# EasyEDA Pro project 4040M主控板V1.0 - ESP32.eprj

# Schematic 原理图
Board Name: ESP32s3; Create Date: 2025-05-14; Page Name: 电源; Project Name: 4040M主控板V1.0; Schematic Name: 原理图; Update Date: 2026-04-21; Company: 嘉立创EDA; Page Size: A3; Version: V1.0
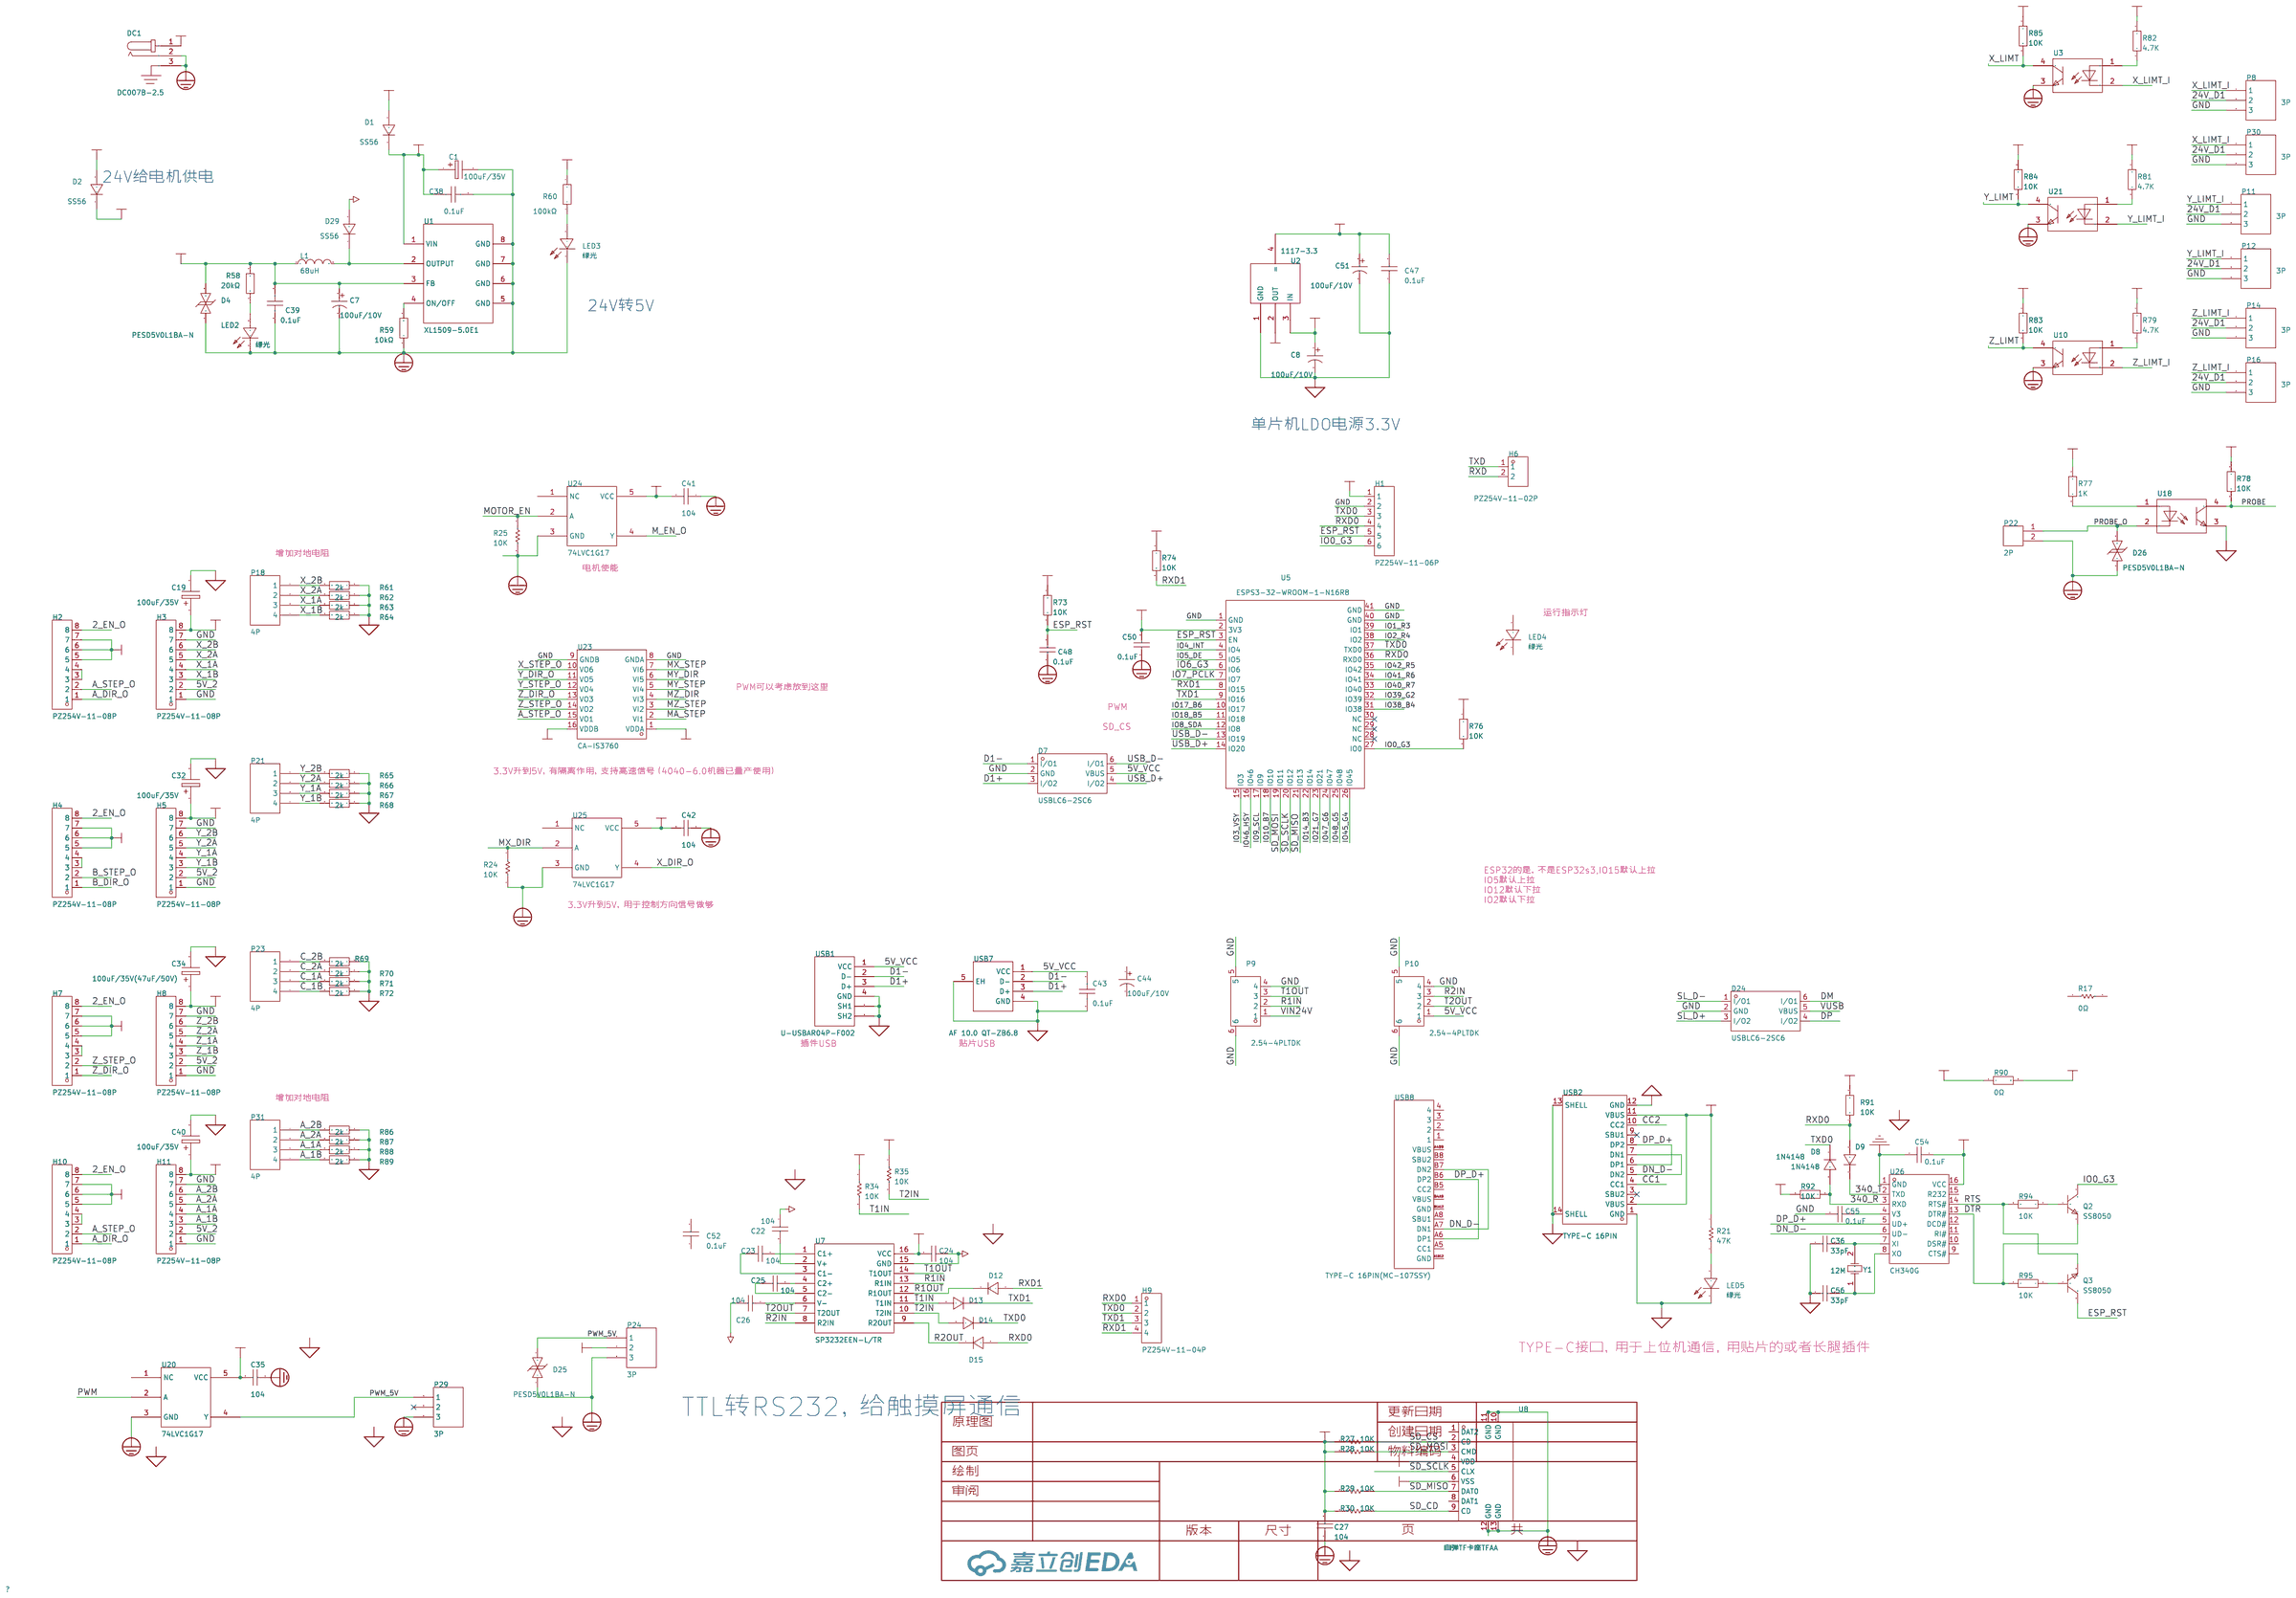
[diagram p0: schematic sheet]

## Parts
C1  100uF/35V  [电解电容贴片6X6]
C7  100uF/10V  [CAP-SMD_BD5.0-L5.3-W5.3-RD]
C8  100uF/10V  [CAP-SMD_BD5.0-L5.3-W5.3-RD]
C19  100uF/35V  [电解电容贴片6X6]
C22  104  [0603C]
C23  104  [0603C]
C24  104  [0603C]
C25  104  [0603C]
C26  104  [0603C]
C27  104  [11]
C32  100uF/35V  [电解电容贴片6X6]
C34  100uF/35V(47uF/50V)  [电解电容贴片6X6]
C35  104  [0603C]
C36  33pF  [C0603]
C38  0.1uF  [C0603]
C39  0.1uF  [C0603]
C40  100uF/35V  [电解电容贴片6X6]
C41  104  [0603C]
C42  104  [0603C]
C43  0.1uF  [C0603]
C44  100uF/10V  [CAP-SMD_BD5.0-L5.3-W5.3-RD]
C47  0.1uF  [C0603]
C48  0.1uF  [C0603]
C50  0.1uF  [C0603]
C51  100uF/10V  [CAP-SMD_BD5.0-L5.3-W5.3-RD]
C52  0.1uF  [C0603]
C54  0.1uF  [C0603]
C55  0.1uF  [C0603]
C56  33pF  [C0603]
D1  SS56  [SMA_L4.3-W2.6-LS5.0-FD]
D2  SS56  [SMA_L4.3-W2.6-LS5.0-FD]
D4  PESD5V0L1BA-N  [SOD-323_L1.8-W1.3-LS2.5-BI]
D7  USBLC6-2SC6  [SOT-23-6_L2.9-W1.6-P0.95-LS2.8-BL]
D8  1N4148  [SOD-323_L1.8-W1.3-LS2.5-RD]
D9  1N4148  [SOD-323_L1.8-W1.3-LS2.5-RD]
D12  1N4148WS  [SOD-323_L1.8-W1.3-LS2.5-RD]
D13  1N4148WS  [SOD-323_L1.8-W1.3-LS2.5-RD]
D14  1N4148WS  [SOD-323_L1.8-W1.3-LS2.5-RD]
D15  1N4148WS  [SOD-323_L1.8-W1.3-LS2.5-RD]
D24  USBLC6-2SC6  [SOT-23-6_L2.9-W1.6-P0.95-LS2.8-BL]
D25  PESD5V0L1BA-N  [SOD-323_L1.8-W1.3-LS2.5-BI]
D26  PESD5V0L1BA-N  [SOD-323_L1.8-W1.3-LS2.5-BI]
D29  SS56  [SMA_L4.3-W2.6-LS5.0-FD]
DC1  DC007B-2.5  [DC-IN-TH_HX-DC007B-2.5]
H1  PZ254V-11-06P  [HDR-TH_6P-P2.54-V-M]
H2  PZ254V-11-08P  [HDR-TH_8P-P2.54-V-M]
H3  PZ254V-11-08P  [HDR-TH_8P-P2.54-V-M]
H4  PZ254V-11-08P  [HDR-TH_8P-P2.54-V-M]
H5  PZ254V-11-08P  [HDR-TH_8P-P2.54-V-M]
H6  PZ254V-11-02P  [HDR-TH_2P-P2.54-V-M]
H7  PZ254V-11-08P  [HDR-TH_8P-P2.54-V-M]
H8  PZ254V-11-08P  [HDR-TH_8P-P2.54-V-M]
H9  PZ254V-11-04P  [HDR-TH_4P-P2.54-V-M]
H10  PZ254V-11-08P  [HDR-TH_8P-P2.54-V-M]
H11  PZ254V-11-08P  [HDR-TH_8P-P2.54-V-M]
L1  68uH  [IND-SMD_L7.0-W7.0_SMDRI74-330MT]
LED2  绿光  [LED0603-RD]
LED3  绿光  [LED0603-RD]
LED4  绿光  [LED0603-RD]
LED5  绿光  [LED0603-RD]
P8  3P  [HDR1X3_CON]
P9  2.54-4PLTDK  [CONN-SMD_4P-P2.50_SHOU_2.54-4PLTDK]
P10  2.54-4PLTDK  [CONN-SMD_4P-P2.50_SHOU_2.54-4PLTDK]
P11  3P  [HDR1X3_CON]
P12  3P  [HDR1X3_CON]
P14  3P  [HDR1X3_CON]
P16  3P  [HDR1X3_CON]
P18  4P  [HDR1X4_CON]
P21  4P  [HDR1X4_CON]
P22  2P  [HDR1X2_CON]
P23  4P  [HDR1X4_CON]
P24  3P  [HDR1X3_CON]
P29  3P  [HDR1X3_CON]
P30  3P  [HDR1X3_CON]
P31  4P  [HDR1X4_CON]
Q2  SS8050  [SOT-23-3_L2.9-W1.3-P1.90-LS2.4-BR]
Q3  SS8050  [SOT-23-3_L2.9-W1.3-P1.90-LS2.4-BR]
R17  0Ω  [10]
R21  47K  [10]
R24  10K  [0603R]
R25  10K  [0603R]
R27  10K  [10]
R28  10K  [10]
R29  10K  [10]
R30  10K  [10]
R34  10K  [10]
R35  10K  [10]
R58  20kΩ  [R0603]
R59  10kΩ  [R0603]
R60  100kΩ  [R0603]
R61  2k  [R0603]
R62  2k  [R0603]
R63  2k  [R0603]
R64  2k  [R0603]
R65  2k  [R0603]
R66  2k  [R0603]
R67  2k  [R0603]
R68  2k  [R0603]
R69  2k  [R0603]
R70  2k  [R0603]
R71  2k  [R0603]
R72  2k  [R0603]
R73  10K  [R0603]
R74  10K  [R0603]
R76  10K  [R0603]
R77  1K  [R0603]
R78  10K  [R0603]
R79  4.7K  [R0603]
R81  4.7K  [R0603]
R82  4.7K  [R0603]
R83  47K  [R0603]
R84  47K  [R0603]
R85  47K  [R0603]
R86  2k  [R0603]
R87  2k  [R0603]
R88  2k  [R0603]
R89  2k  [R0603]
R90  0Ω  [R0603]
R91  10K  [R0603]
R92  10K  [R0603]
R94  10K  [R0603]
R95  10K  [R0603]
U1  XL1509-5.0E1  [ESOP-8_L4.9-W3.9-P1.27-LS6.0-BL-EP]
U2  1117-3.3  [SOT-223]
U3  LTV-357T-C  [SOP-4_L4.4-W3.9-P2.54-LS7.0-TL]
U5  ESPS3-32-WROOM-1-N16R8  [WIRELM-SMD_ESP32-S3-WROOM-2-N32R8V]
U7  SP3232EEN-L/TR  [SOIC-16_L9.9-W3.9-P1.27-LS6.0-BL]
U8  自弹TF卡座TFAA  [SIM-SMD_C9900015645]
U10  LTV-357T-C  [SOP-4_L4.4-W3.9-P2.54-LS7.0-TL]
U18  LTV-357T-C  [SOP-4_L4.4-W3.9-P2.54-LS7.0-TL]
U20  74LVC1G17  [SOT-23-5]
U21  LTV-357T-C  [SOP-4_L4.4-W3.9-P2.54-LS7.0-TL]
U23  CA-IS3760  [SOIC-16_L9.9-W3.9-P1.27-LS6.0-BL]
U24  74LVC1G17  [SOT-23-5]
U25  74LVC1G17  [SOT-23-5]
U26  CH340G  [SOIC-16_L9.9-W3.9-P1.27-LS6.0-BL]
USB1  U-USBAR04P-F002  [USB-A-TH_USB-302-T]
USB2  TYPE-C 16PIN  [USB-C-SMD_TYPE-C-6PIN+]
USB7  AF 10.0 QT-ZB6.8  [USB-A-SMD_AF-10.0-QT-ZB6.8]
USB8  TYPE-C 16PIN(MC-107SSY)  [USB-TYPE-C-SMD_MC-107SSY]
Y1  12M  [晶振贴片49SSMD]

## Library data of the parts
C1 C19 C32 C34 C40 = 100uF/35V: Origin Footprint 2: X47U; Origin Footprint 1: 电解电容贴片6x6; Design Item ID: ELECTRO1; Library Name: *
C7 C8 C44 C51 = CS1A101M-CRD54: 容值:100uF;精度:±20%;额定电压:10V;电容体直径:5mm;电容体长度:5.4mm;纹波电流:-;等效串联电阻:-;工作寿命:1000hrs@105℃;工作温度:-40℃~+105℃;; LCSC Part Name: 100uF ±20% 10V; Supplier Part: C96182; Manufacturer: ST(先科); Supplier Footprint: SMD,5x5.4mm; JLCPCB Part Class: Extended Part; Datasheet: https://atta.szlcsc.com/upload/public/pdf/source/20170304/1488621207726.pdf; Supplier: LCSC; Tolerance: ±20%; Rated Voltage: 10V; φD: 5mm; L: 5.4mm; Lifetime @ Temp: 1000hrs@105℃; Operating Temperature: -40℃~+105℃
C22-C26 = 103: Capacitor (Semiconductor SIM Model); Published: 8-Jun-2000; LatestRevisionDate: 17-Jul-2002; LatestRevisionNote: Re-released for DXP Platform.; PackageReference: C1206; Publisher: Altium Limited; Origin Footprint 2: C1206; Origin Footprint 3: 0402; Origin Footprint 4: 1310[0504]; Origin Footprint 5: 1608[0603]; Origin Footprint 6: C1210; Origin Footprint 7: C0805; Origin Footprint 8: C1206; Origin Footprint 9: 0805; Origin Footprint 10: 0805L; Design Item ID: Cap Semi; Library Name: Miscellaneous Devices
C27 = 104: Capacitor (Semiconductor SIM Model); Published: 8-Jun-2000; LatestRevisionDate: 17-Jul-2002; LatestRevisionNote: Re-released for DXP Platform.; PackageReference: C1206; Publisher: Altium Limited; Origin Footprint 2: C1206; Origin Footprint 3: 0402; Origin Footprint 4: 1310[0504]; Origin Footprint 5: 1608[0603]; Origin Footprint 6: C1210; Origin Footprint 7: C0805; Origin Footprint 8: C1206; Origin Footprint 9: 0805; Origin Footprint 10: 0805L; Origin Footprint 11: 0805C; Origin Footprint 1: 0603C; Design Item ID: Cap Semi; Library Name: Miscellaneous Devices
C35 C41 C42 = 104: Capacitor (Semiconductor SIM Model); Published: 8-Jun-2000; LatestRevisionDate: 17-Jul-2002; LatestRevisionNote: Re-released for DXP Platform.; PackageReference: C1206; Publisher: Altium Limited; Origin Footprint 2: C1206; Origin Footprint 3: 0402; Origin Footprint 4: 1310[0504]; Origin Footprint 5: 1608[0603]; Origin Footprint 6: C1210; Origin Footprint 7: C0805; Origin Footprint 8: C1206; Origin Footprint 9: 0805; Origin Footprint 10: 0805L; Design Item ID: Cap Semi; Library Name: Miscellaneous Devices
C36 C56 = CL10C120JB8NNNC: LCSC Part Name: 12pF ±5% 50V; Supplier Part: C38523; Manufacturer: SAMSUNG(三星); Supplier Footprint: 0603; JLCPCB Part Class: 基础库; Datasheet: https://item.szlcsc.com/datasheet/CL10C120JB8NNNC/39506.html; Supplier: LCSC; Tolerance: ±5%; Voltage Rating: 50V; Temperature Coefficient: C0G
C38 C39 C43 = 0603B822K500NT: LCSC Part Name: 8.2nF ±10% 50V; Supplier Part: C1322360; Manufacturer: FH(风华); Supplier Footprint: 0603; JLCPCB Part Class: 基础库; Datasheet: https://item.szlcsc.com/datasheet/0603B822K500NT/1413077.html; Supplier: LCSC; Tolerance: ±10%; Voltage Rating: 50V; Temperature Coefficient: X7R
C47 C48 C50 C52 C54 C55 = 0603B682K500NT: LCSC Part Name: 6.8nF ±10% 50V; Supplier Part: C1631; Manufacturer: FH(风华); Supplier Footprint: 0603; JLCPCB Part Class: 基础库; Datasheet: https://item.szlcsc.com/datasheet/0603B682K500NT/1983.html; Supplier: LCSC; Tolerance: ±10%; Voltage Rating: 50V; Temperature Coefficient: X7R
D1 D2 D29 = SS34-SMA: Supplier Part: C9900004127; Supplier Footprint: SMA_L4.3-W2.6-LS5.2; JLCPCB Part Class: 扩展库; Supplier: LCSC
D4 D25 D26 = PESD5V0S1BBN: 极性:Bidirectional;反向关断电压（典型值）:5V (Max);击穿电压（最小值）:6V;箝位电压:15V;峰值脉冲电流（10/1000us）:5A (8/20us);; Supplier Part: C314264; Manufacturer: BORN伯恩半导体; Supplier Footprint: SOD-523; JLCPCB Part Class: Extended Part; Datasheet: https://atta.szlcsc.com/upload/public/pdf/source/20181015/C314264_F9AC5761AC2631DA841FBD1D9C6821E3.pdf; Supplier: LCSC; Polarity: Bidirectional; Voltage - Reverse Standoff (Typ): 5V (Max); Voltage - Breakdown (Min): 6V; Voltage - Clamping (Max) @ Ipp: 15V; Current - Peak Pulse (10/1000μs): 5A (8/20us)
D7 D24 = USBLC6-2SC6: 最大钳位电压:15V;击穿电压:6V;; Supplier Part: C2687116; Manufacturer: UMW(友台半导体); Supplier Footprint: SOT-23-6; JLCPCB Part Class: 扩展库; Datasheet: https://atta.szlcsc.com/upload/public/pdf/source/20231109/512642D850D9873E7C519F71E85B9A10.pdf; Supplier: LCSC; Maximum Clamping Voltage: 15V; Breakdown Voltage: 6V; Number of Lines: 双路; Type: ESD
D8 D9 D12-D15 = 1N4148WS_C2128: 二极管配置:独立式;正向压降(Vf):1.25V@150mA;直流反向耐压(Vr):100V;整流电流:150mA;反向恢复时间(Trr):4ns;; LCSC Part Name: 丝印T4 1N4148WS; Supplier Part: C2128; Manufacturer: CJ(江苏长电/长晶); Supplier Footprint: SOD-323; JLCPCB Part Class: 基础库; Datasheet: https://item.szlcsc.com/datasheet/1N4148WS/2485.html; Supplier: LCSC; Diode Configuration: 独立式; Voltage - Forward(Vf@If): 1.25V@150mA; Voltage - DC Reverse(Vr): 100V; Current - Rectified: 150mA; Pd - Power Dissipation: 200mW; Reverse Leakage Current (Ir): 1uA@75V; Reverse Recovery Time (trr): 4ns; Non-Repetitive Peak Forward Surge Current: 2A
DC1 = DC007B-2.5: 连接器类型:DC电源插座;安装方式:弯插;触点内径:2.5mm;触点外径:7.7mm;额定电流:5A;额定电压:20V;工作温度:-25℃~+70℃;; LCSC Part Name: DC电源插座 内径:2.5mm 外径:7.7mm; Supplier Part: C17701685; Manufacturer: SHOU HAN(首韩); Supplier Footprint: 插件; JLCPCB Part Class: 扩展库; Datasheet: https://atta.szlcsc.com/upload/public/pdf/source/20230912/B85EC3863CDA4EDD9FBFF38F4F2C356A.pdf; Supplier: LCSC; Connector Type: DC电源插座; Mounting Type: 弯插; Inside Contact Diameter: 2.5mm; Outside Contact Diameter: 7.7mm; Current Rating: 5A; Voltage Rating (Max): 20V; Operating Temperature: -25℃~+70℃
H1 = PZ254V-11-06P: 插针结构:1x6P;间距:2.54mm;行距:-;圆针/方针:方针;安装方式:直插;排数:单排;总PIN位数:6P;额定电流:-;额定电压:-;配合针长度:6mm;塑高:2.5mm;端接针长度:3mm;触头材质:黄铜;触头镀层:-;工作温度:-40℃~+105℃;颜色:黑色;; LCSC Part Name: 1x6P 间距:2.54mm 方针 直插; Supplier Part: C492405; Manufacturer: XFCN(兴飞); Supplier Footprint: 插件,P=2.54mm; JLCPCB Part Class: 扩展库; Datasheet: https://item.szlcsc.com/datasheet/PZ254V-11-06P/502961.html; Supplier: LCSC; Pin Structure: 1x6P; Pitch: 2.54mm; Circluar Pins/Square Pins: 方针; Mounting Type: 直插; Number of Rows: 单排; Number of Pins: 6P; Length of Mating Pin: 6mm; Insulation Height: 2.5mm; Length of End Connection Pin: 3mm; Contact Material: 黄铜; Operating Temperature: -40℃~+105℃; Color: 黑色
H2-H5 H7 H8 H10 H11 = PZ254V-11-08P: LCSC Part Name: 间距:2.54mm 1x8P 直插 方针; Supplier Part: C492407; Manufacturer: XFCN(兴飞); Supplier Footprint: 插件,P=2.54mm; JLCPCB Part Class: 扩展库; Datasheet: https://atta.szlcsc.com/upload/public/pdf/source/20200309/C492407_83A6FB26A2233368EDB9516968EC6149.pdf; Supplier: LCSC; Pin Structure: 1x8P; Pitch: 2.54mm; Circluar Pins/Square Pins: 方针; Mounting Type: 直插; Number of Rows: 单排; Number of Pins: 8P; Length of Mating Pin: 6mm; Insulation Height: 2.5mm; Length of End Connection Pin: 3mm; Contact Material: 黄铜; Operating Temperature Range: -40℃~+105℃; Color: 黑色
H6 = PZ254V-11-02P: 插针结构:1x2P;间距:2.54mm;行距:-;圆针/方针:方针;安装类型:直插;排数:单排;总PIN位数:2P;额定电流:-;额定电压:-;配合针长度:6mm;塑高:2.5mm;端接针长度:3mm;触头材质:黄铜;触头镀层:-;工作温度范围:-40℃~+105℃;颜色:黑色;; LCSC Part Name: 间距:2.54mm 1x2P 直插 方针; Supplier Part: C492401; Manufacturer: XFCN(兴飞); Supplier Footprint: 插件,P=2.54mm; JLCPCB Part Class: 扩展库; Datasheet: https://atta.szlcsc.com/upload/public/pdf/source/20200309/C492401_A812433581A9B211A7FFA413ADDFF0E5.pdf; Supplier: LCSC; Pin Structure: 1x2P; Pitch: 2.54mm; Circluar Pins/Square Pins: 方针; Mounting Type: 直插; Number of Rows: 单排; Number of Pins: 2P; Length of Mating Pin: 6mm; Insulation Height: 2.5mm; Length of End Connection Pin: 3mm; Contact Material: 黄铜; Operating Temperature Range: -40℃~+105℃; Color: 黑色
H9 = PZ254V-11-04P: LCSC Part Name: 1x4P 间距:2.54mm 方针 直插; Supplier Part: C2691448; Manufacturer: XFCN(兴飞); Supplier Footprint: 插件,P=2.54mm; JLCPCB Part Class: 扩展库; Datasheet: https://item.szlcsc.com/datasheet/PZ254V-11-04P/2801085.html; Supplier: LCSC; Pin Structure: 1x4P; Pitch: 2.54mm; Circluar Pins/Square Pins: 方针; Mounting Type: 直插; Number of Rows: 单排; Number of Pins: 4P; Current Rating: 3A; Voltage Rating (Max): 250V; Length of Mating Pin: 6mm; Insulation Height: 2.5mm; Length of End Connection Pin: 3mm; Operating Temperature: -40℃~+105℃; Color: 黑色
L1 = SMDRI74-330MT: 电感值:33uH;精度:±20%;额定电流:960mA;饱和电流(Isat):1.8A;类型:屏蔽电感;; LCSC Part Name: 33uH±20%1.8A; Supplier Part: C49625; Manufacturer: SXN(顺翔诺); Supplier Footprint: SMD,7.5x7.5mm; JLCPCB Part Class: 扩展库; Datasheet: https://atta.szlcsc.com/upload/public/pdf/source/20210810/6F96FDC19AA308DD2AD166FFB9640E87.pdf; Supplier: LCSC; Tolerance: ±20%; Rated Current: 960mA; Saturation Current (Isat): 1.8A; DC Resistance (DCR): 170mΩ; Type: 屏蔽电感
LED2-LED5 = KT-0603R: LCSC Part Name: 0603 红灯 高亮; Supplier Part: C2286; Manufacturer: KENTO; Supplier Footprint: 0603; JLCPCB Part Class: 基础库; Datasheet: https://item.szlcsc.com/datasheet/KT-0603R/2659.html; Supplier: LCSC; Illumination Color: 红色; Voltage - Forward(Vf): 1.8V~2.4V; Power(Watts): 40mW; Forward Current: 20mA; Wavelength - Dominant: 615nm~630nm; Peak Wavelength: 645nm; Diode Configuration: 独立二极管; Lens Color: 无色透明透镜; Luminous Intensity: 300mcd; Viewing Angle: 120°; Operating Temperature: -40℃~+85℃
P8 P11 P12 P14 P16 P24 P29 P30 = 3P: Library Name: SCH封装库
P9 P10 = 2.54-4PLTDK: 插针结构:1x4P;间距:2.5mm;安装方式:立贴;参考系列:XHB;总PIN数:4P;排数:1;每排PIN数:4;额定电流:3A;触头材质:黄铜;触头镀层:锡;工作温度:-25℃~+85℃;; LCSC Part Name: 2.54-4P立贴加盖带扣编带; Supplier Part: C3008569; Manufacturer: SHOU HAN(首韩); Supplier Footprint: SMD,P=2.5mm; JLCPCB Part Class: 扩展库; Datasheet: https://item.szlcsc.com/datasheet/2.54-4PLTDK/3501416.html; Supplier: LCSC; Pins Structure: 1x4P; Pitch: 2.5mm; Mounting Type: 立贴; Reference Series: XHB; Number of Pins: 4P; Number of Rows: 1; Number of PINs Per Row: 4; Current Rating: 3A; Contact Material: 黄铜; Contact Plating: 锡; Operating Temperature: -25℃~+85℃; Voltage Rating: 250V; Plastic Material: LCP; Flame Retardant Rating: UL94V-0; Color: 米色
P18 P21 P23 P31 = 4P: Library Name: SCH封装库
P22 = 2P: Library Name: SCH--װ--
Q2 Q3 = SS8050: LCSC Part Name: NPN 25V 1.5A 120-400 SOT-23; Supplier Part: C2931717; Manufacturer: Doeshare(德芯); Supplier Footprint: SOT-23; JLCPCB Part Class: 扩展库; Datasheet: https://atta.szlcsc.com/upload/public/pdf/source/20220106/99F9A3DFCBDD91265C711555CE6390BF.pdf; Supplier: LCSC
R17 R21 R27-R30 R34 R35 = 10K: Resistor; Published: 8-Jun-2000; LatestRevisionDate: 17-Jul-2002; LatestRevisionNote: Re-released for DXP Platform.; PackageReference: AXIAL-0.3; Publisher: Altium Limited; Origin Footprint 2: AXIAL-0.3; Origin Footprint 3: R0805; Origin Footprint 4: 0805R; Origin Footprint 1: 0603R; Design Item ID: RES; Library Name: SCH封装库
R24 R25 = 10K: Resistor; Published: 8-Jun-2000; LatestRevisionDate: 17-Jul-2002; LatestRevisionNote: Re-released for DXP Platform.; PackageReference: AXIAL-0.3; Publisher: Altium Limited; Origin Footprint 2: AXIAL-0.3; Origin Footprint 3: R0805; Origin Footprint 4: 0805R; Design Item ID: RES; Library Name: SCH--װ--
R58-R74 R76-R79 R81-R92 R94 R95 = 0603WAF2402T5E: LCSC Part Name: 24kΩ ±1% 100mW 厚膜电阻; Supplier Part: C23352; Manufacturer: UNI-ROYAL(厚声); Supplier Footprint: 0603; JLCPCB Part Class: 基础库; Datasheet: https://item.szlcsc.com/datasheet/0603WAF2402T5E/24085.html; Supplier: LCSC; Type: 厚膜电阻; Tolerance: ±1%; Power(Watts): 100mW; Voltage-Supply(Max): 75V; Temperature Coefficient: ±100ppm/℃; Operating Temperature: -55℃~+155℃
U1 = XL1509-5.0E1: 功能类型:降压型;同步整流:-;输出通道数:-;拓扑结构:-;输入电压:-;输出电流(最大值):-;开关频率:-;; LCSC Part Name: 降压型; Supplier Part: C61063; Manufacturer: XLSEMI(芯龙); Supplier Footprint: SOP-8_150mil; JLCPCB Part Class: Basic Part; Datasheet: https://atta.szlcsc.com/upload/public/pdf/source/20151020/1457707483545.pdf; Supplier: LCSC; Function: 降压型
U2 = 1117-3.3: Design Item ID: LM1117; Library Name: Party600
U3 U10 U18 U21 = LTV-357T-C: 输入电压类型:DC;正向电压:1.2V;输出电流:50mA;隔离电压(rms):3.75kV;反向电压:6V;接收端电压:35V;输出通道数:1;集射极饱和电压(Vce(sat)@Ic,IF):200mV@1mA,20mA;; Supplier: LCSC; Manufacturer: LITEON(光宝); Supplier Part: C119091; JLCPCB Part Class: 扩展库; LCSC Part Name: DC输入隔离电压(rms):3750V; Supplier Footprint: SOP-4-2.54mm; Datasheet: https://atta.szlcsc.com/upload/public/pdf/source/20170930/C133128_1506736380934997376.pdf; Input voltage type: DC; Output Type: 光电三极管; Forward Voltage: 1.2V; Output Current: 50mA; Isolation Voltage(rms): 3.75kV; Reverse Voltage: 6V; Receiving End Voltage: 35V; Number of Outputs: 1; Collector-Emitter Saturation Voltage (Vce(sat)@Ic,IF): 200mV@1mA,20mA; Rise time: 4us@2mA,100Ω; Fall time: 3us@2mA,100Ω; Operating Temperature: -55℃~+110℃
U5 = ESP32-S3-WROOM-2-N32R8V: Supplier Part: C3021270; Manufacturer: ESPRESSIF(乐鑫); Supplier Footprint: SMD-41P; JLCPCB Part Class: 扩展库; Datasheet: https://atta.szlcsc.com/upload/public/pdf/source/20240130/C1D348304CAAF72A05B43D2BF874139A.pdf; Supplier: LCSC; Core Processor: ESP32-S3R8V芯片; Support Interface: I2C；GPIO；SPI；PWM；ADC；UART；USB；I2S; Output Power: 20.5dBm
U7 = SP3232EEN-L/TR: LCSC Part Name: True3.0V至5.5V RS-232收发器; Supplier Part: C9378; Manufacturer: MaxLinear(迈凌); Supplier Footprint: SOIC-16; JLCPCB Part Class: 扩展库; Datasheet: https://item.szlcsc.com/datasheet/SP3232EEN-L%252FTR/9907.html; Supplier: LCSC; Type: 收发器; Number of Drivers: 2; Number of Receivers: 2; Data Rate: 235Kbps; Voltage - Supply: 3V~5.5V; Operating Temperature: -40℃~+85℃
U8 = 自弹TF卡座TFAA: Supplier Part: C9900015645; Supplier Footprint: SMD; JLCPCB Part Class: 扩展库; Supplier: LCSC
U20 U24 U25 = 74LVC1G04: Library Name: SCH--װ--
U23 = CA-IS3760HN: LCSC Part Name: CA‐IS376x 高速六通道数字隔离器; Supplier Part: C19723481; Manufacturer: Chipanalog(川土微); Supplier Footprint: SOIC-16-NB; JLCPCB Part Class: 扩展库; Datasheet: https://atta.szlcsc.com/upload/public/pdf/source/20231222/0EEB57886E3672BACB4CFC71CD69856C.pdf; Supplier: LCSC
U26 = CH340G: 应用功能:收发器;接口协议:USB 2.0;数据速率:2Mbps;; LCSC Part Name: USB转串口芯片 CH340; Supplier Part: C14267; Manufacturer: WCH(南京沁恒); Supplier Footprint: SOP-16; JLCPCB Part Class: 扩展库; Datasheet: https://atta.szlcsc.com/upload/public/pdf/source/20230530/6E401E9554E9F5311886CC8B3F89B62E.pdf; Supplier: LCSC; Applications Function: 收发器; Protocol: USB 2.0; Supply Voltage: 3.3V；5V; Data Rate: 2Mbps
USB1 = U-USBAR04P-F002: 连接器类型:Type-A;协议标准:USB 2.0;公母:母;安装方式:弯插;触点数量:4P;端口数量:1;额定电流 - 电源:1.5A;工作温度:0℃~+50℃;; LCSC Part Name: USB母座; Supplier Part: C386736; Manufacturer: Ckmtw(灿科盟); Supplier Footprint: 弯插; JLCPCB Part Class: 扩展库; Datasheet: https://item.szlcsc.com/datasheet/U-USBAR04P-F002/360843.html; Supplier: LCSC; Connector Type: Type-A; Protocol Standard: USB 2.0; Gender: 母; Mounting Type: 弯插; Number of Contacts: 4P; Number of Ports: 1; Current Rating-Power: 1.5A; Voltage Rating: 30V; Length: 14mm; Detection color: 白色; Operating Temperature: 0℃~+50℃
USB2 = TYPE-C 16PIN 2MD(073): 连接器类型:Type-C;标准:-;公母:母;端口数量:1;触点数量:16P;安装方式:卧贴;额定电流 - 电源:5A;工作温度范围:-25℃~+85℃;; LCSC Part Name: Type-C 母 卧贴; Supplier Part: C2765186; Manufacturer: SHOU HAN(首韩); Supplier Footprint: SMD; JLCPCB Part Class: Extended Part; Datasheet: https://atta.szlcsc.com/upload/public/pdf/source/20211123/39B17C16241EAC15C5E277BDA434118E.pdf; Supplier: LCSC; Connector Type: Type-C; Gender: 母; Number of Ports: 1; Number of Contacts: 16P; Mounting Style: 卧贴; Current Rating - Power (Max): 5A; Operating Temperature Range: -25℃~+85℃
USB7 = AF 10.0 QT-ZB6.8: 连接器类型:Type-A;协议标准:USB 2.0;公母:母;安装方式:卧贴;触点数量:4P;端口数量:1;额定电流 - 电源:1.5A;工作温度:-25℃~+85℃;; LCSC Part Name: Type-A 母 卧贴; Supplier Part: C456016; Manufacturer: SHOU HAN(首韩); Supplier Footprint: SMD; Datasheet: https://item.szlcsc.com/datasheet/AF%252010.0%2520QT-ZB6.8/458823.html; Supplier: LCSC; Connector Type: Type-A; Protocol Standard: USB 2.0; Gender: 母; Mounting Type: 卧贴; Number of Contacts: 4P; Number of Ports: 1; Current Rating-Power: 1.5A; Voltage Rating: 30V; Connect-Disconnect Life: 5千次; Length: 10mm; Detection color: 黑色; Operating Temperature: -25℃~+85℃
USB8 = MC-107SSY: LCSC Part Name: Type-C 母 卧贴; Supplier Part: C3039307; Manufacturer: HANBO(汉博); Supplier Footprint: SMD; JLCPCB Part Class: 扩展库; Datasheet: https://item.szlcsc.com/datasheet/MC-107SSY/3592983.html; Supplier: LCSC; Connector Type: Type-C; Protocol Standard: USB 3.1; Gender: 母; Mounting Type: 卧贴; Number of Contacts: 16P; Number of Ports: 1; Current Rating-Power: 5A; Voltage Rating: 5V; Connect-Disconnect Life: 1万次; Operating Temperature: -25℃~+85℃
Y1 = 12M: Crystal Oscillator; Published: 8-Jun-2000; LatestRevisionDate: 17-Jul-2002; LatestRevisionNote: Re-released for DXP Platform.; PackageReference: R38; Publisher: Altium Limited; Origin Footprint 2: R38; Origin Footprint 3: XTAL-49S; Design Item ID: XTAL; Library Name: Miscellaneous Devices

## Nets
3V3: C27.2 C47.2 C50.2 C51.1 R27.2 R28.2 R29.2 R30.2 R73.1 R74.1 R76.1 R78.1 R83.1 R84.1 R85.1 R91.2 U2.2(OUT) U2.4(=) U5.2(3V3) U8.4(VDD) U23.1(VDDA)
5V_2: H2.5 H2.6 H2.7 H3.2 H4.5 H4.6 H4.7 H5.2 H7.5 H7.6 H7.7 H8.2 H10.5 H10.6 H10.7 H11.2
5V_USB: R21.1 R90.1 USB2.2(VBUS) USB2.11(VBUS)
5V_VCC: C7.1 C8.1 C24.2 C35.2 C39.2 C41.2 C42.2 C43.2 C54.1 D4.2 D7.5(VBUS) H1.1 L1.1 P10.1 R34.1 R35.1 R58.2 R77.1 R90.2 R92.2 U1.3(FB) U2.3(IN) U7.16(VCC) U20.5(VCC) U23.16(VDDB) U24.5(VCC) U25.5(VCC) U26.16(VCC) USB1.1(VCC) USB7.1(VCC)
24V_D1: C1.1 C38.1 D1.1 P8.2 P11.2 P12.2 P14.2 P16.2 P24.2 P30.2 R60.2 R79.1 R81.1 R82.1 U1.1(VIN)
24V_D2: C19.1 C32.1 C34.1 C40.1 D2.1 H3.8 H5.8 H8.8 H11.8
GND: C1.2 C7.2 C8.2 C19.2 C22.1 C24.1 C26.2 C27.1 C32.2 C34.2 C35.1 C36.1 C38.2 C39.1 C40.2 C41.1 C42.1 C43.1 C47.1 C48.1 C50.1 C51.2 C54.2 C55.2 C56.1 D4.1 D7.2(GND) D24.2(GND) D25.1 D26.1 D29.2 DC1.2 DC1.3 H1.2 H3.1 H3.7 H5.1 H5.7 H8.1 H8.7 H11.1 H11.7 LED2.1(K) LED3.1(K) LED5.1(K) P8.3 P9.4 P9.5 P9.6 P10.4 P10.5 P10.6 P11.3 P12.3 P14.3 P16.3 P22.2 P24.3 P29.3 P30.3 R24.2 R25.2 R59.1 R61.1 R62.1 R63.1 R64.1 R65.1 R66.1 R67.1 R68.1 R69.1 R70.1 R71.1 R72.1 R86.1 R87.1 R88.1 R89.1 U1.5(GND) U1.6(GND) U1.7(GND) U1.8(GND) U2.1(GND) U3.3 U5.1(GND) U5.40(GND) U5.41(GND) U7.15(GND) U8.6(VSS) U8.10(GND) U8.11(GND) U8.12(GND) U8.13(GND) U10.3 U18.3 U20.3(GND) U21.3 U23.8(GNDA) U23.9(GNDB) U24.3(GND) U25.3(GND) U26.1(GND) USB1.4(GND) USB1.5(SH1) USB1.6(SH2) USB2.1(GND) USB2.12(GND) USB2.13(SHELL) USB2.14(SHELL) USB7.4(GND) USB7.5(EH)
VIN24V: D1.2 D2.2 DC1.1 P9.1
2_EN_O: H2.8 H4.8 H7.8 H10.8
340_R: D8.2(A) R92.1 U26.3(RXD)
340_T: D9.1(K) U26.2(TXD)
A_1A: H11.4 P31.3 R88.2
A_1B: H11.3 P31.4 R89.2
A_2A: H11.5 P31.2 R87.2
A_2B: H11.6 P31.1 R86.2
A_DIR_O: H2.1 H10.1
A_STEP_O: H2.2 H10.2 U23.15(VO1)
B_DIR_O: H4.1
B_STEP_O: H4.2
C_1A: P23.3 R71.2
C_1B: P23.4 R72.2
C_2A: P23.2 R70.2
C_2B: P23.1 R69.2
CC1: USB2.4(CC1)
CC2: USB2.10(CC2)
D1+: D7.3(I/O2) USB1.3(D+) USB7.3(D+)
D1-: D7.1(I/O1) USB1.2(D-) USB7.2(D-)
DM: D24.6(I/O1)
DN_D-: U26.6(UD-) USB2.5(DN2) USB2.7(DN1) USB8.A7(DN1) USB8.B7(DN2)
DP: D24.4(I/O2)
DP_D+: U26.5(UD+) USB2.6(DP1) USB2.8(DP2) USB8.A6(DP1) USB8.B6(DP2)
DTR: Q2.2(E) R95.2 U26.13(DTR#)
ESP_RST: C48.2 H1.5 Q3.3(C) R73.2 U5.3(EN)
IO0_G3: H1.6 Q2.3(C) R76.2 U5.27(IO0)
IO1_R3: U5.39(IO1)
IO2_R4: U5.38(IO2)
IO3_VSY: U5.15(IO3)
IO4_INT: U5.4(IO4)
IO5_DE: U5.5(IO5)
IO6_G3: U5.6(IO6)
IO7_PCLK: U5.7(IO7)
IO8_SDA: U5.12(IO8)
IO9_SCL: U5.17(IO9)
IO10_B7: U5.18(IO10)
IO14_B3: U5.22(IO14)
IO17_B6: U5.10(IO17)
IO18_B5: U5.11(IO18)
IO21_G7: U5.23(IO21)
IO38_B4: U5.31(IO38)
IO39_G2: U5.32(IO39)
IO40_R7: U5.33(IO40)
IO41_R6: U5.34(IO41)
IO42_R5: U5.35(IO42)
IO45_G4: U5.26(IO45)
IO46_HSY: U5.16(IO46)
IO47_G6: U5.24(IO47)
IO48_G5: U5.25(IO48)
M_EN_O: U24.4(Y)
MA_STEP: U23.2(VI1)
MOTOR_EN: R25.1 U24.2(A)
MX_DIR: R24.1 U25.2(A)
MX_STEP: U23.7(VI6)
MY_DIR: U23.6(VI5)
MY_STEP: U23.5(VI4)
MZ_DIR: U23.4(VI3)
MZ_STEP: U23.3(VI2)
PROBE: R78.2 U18.4
PROBE_O: D26.2 P22.1 U18.2
PWM: U20.2(A)
PWM_5V: D25.2 P24.1 P29.1 U20.4(Y)
R1IN: P9.2 U7.13(R1IN)
R1OUT: D12.1(K) U7.12(R1OUT)
R2IN: P10.3 U7.8(R2IN)
R2OUT: D15.1(K) U7.9(R2OUT)
RTS: Q3.2(E) R94.2 U26.14(RTS#)
RXD: H6.2
RXD0: D9.2(A) D15.2(A) H1.4 H9.1 R91.1 U5.36(RXD0)
RXD1: D12.2(A) H9.4 R74.2 U5.8(IO15)
SD_CD: R30.1 U8.9(CD)
SD_CS: R27.1 U8.2(CD)
SD_MISO: R29.1 U5.21(IO13) U8.7(DAT0)
SD_MOSI: R28.1 U5.19(IO11) U8.3(CMD)
SD_SCLK: U5.20(IO12) U8.5(CLX)
SL_D+: D24.3(I/O2)
SL_D-: D24.1(I/O1)
T1IN: D13.2(A) R34.2 U7.11(T1IN)
T1OUT: P9.3 U7.14(T1OUT)
T2IN: D14.2(A) R35.2 U7.10(T2IN)
T2OUT: P10.2 U7.7(T2OUT)
TXD: H6.1
TXD0: D8.1(K) D14.1(K) H1.3 H9.2 U5.37(TXD0)
TXD1: D13.1(K) H9.3 U5.9(IO16)
USB_D+: D7.4(I/O2) U5.14(IO20)
USB_D-: D7.6(I/O1) U5.13(IO19)
VUSB: D24.5(VBUS)
X_1A: H3.4 P18.3 R63.2
X_1B: H3.3 P18.4 R64.2
X_2A: H3.5 P18.2 R62.2
X_2B: H3.6 P18.1 R61.2
X_DIR_O: U25.4(Y)
X_LIMT: R85.2 U3.4
X_LIMT_I: P8.1 P30.1 U3.2
X_STEP_O: U23.10(VO6)
Y_1A: H5.4 P21.3 R67.2
Y_1B: H5.3 P21.4 R68.2
Y_2A: H5.5 P21.2 R66.2
Y_2B: H5.6 P21.1 R65.2
Y_DIR_O: U23.11(VO5)
Y_LIMT: R84.2 U21.4
Y_LIMT_I: P11.1 P12.1 U21.2
Y_STEP_O: U23.12(VO4)
Z_1A: H8.4
Z_1B: H8.3
Z_2A: H8.5
Z_2B: H8.6
Z_DIR_O: H7.1 U23.13(VO3)
Z_LIMT: R83.2 U10.4
Z_LIMT_I: P14.1 P16.1 U10.2
Z_STEP_O: H7.2 U23.14(VO2)
$9N274640: D29.1 L1.2 U1.2(OUTPUT)
$9N274642: R59.2 U1.4(ON/OFF)
$9N276822: C26.1 U7.6(V-)
$9N276825: C22.2 U7.2(V+)
$9N276826: C25.2 U7.4(C2+)
$9N276827: C25.1 U7.5(C2-)
$9N276828: C23.2 U7.1(C1+)
$9N276829: C23.1 U7.3(C1-)
$9N305570: H2.3 H2.4
$9N305962: H4.3 H4.4
$9N306354: H7.3 H7.4
$9N307221: R82.2 U3.1
$9N307261: R81.2 U21.1
$9N307269: R79.2 U10.1
$9N307549: R77.2 U18.1
$9N311576: LED2.2(A) R58.1
$9N311623: LED3.2(A) R60.1
$9N316563: H10.3 H10.4
Net-(C36-2): C36.2 U26.7(XI) Y1.2(OSC2)
Net-(C55-1): C55.1 U26.4(V3)
Net-(C56-2): C56.2 U26.8(XO) Y1.1(OSC1)
Net-(LED5-2): LED5.2(A) R21.2
Net-(Q2-1): Q2.1(B) R94.1
Net-(Q3-1): Q3.1(B) R95.1

Not connected (* = marked no-connect by the designer): C44 1 2; C52 1 2; LED4 1(K) 2(A); P29 2*; R17 1 2; U5 28(NC)* 29(NC)* 30(NC)*; U8 1(DAT2) 8(DAT1); U20 1(NC); U24 1(NC); U25 1(NC); U26 9(CTS#) 10(DSR#) 11(RI#) 12(DCD#) 15(R232); USB2 3(SBU2)* 9(SBU1)*; USB8 1 2 3 4 A1B12(GND) A4B9(VBUS) A5(CC1) A8(SBU1) B1A12(GND) B4A9(VBUS) B5(CC2) B8(SBU2)

## Notes on the sheet
- 24V给电机供电
- 24V转5V
- 单片机LDO电源3.3V
- 增加对地电阻
- 电机使能
- 运行指示灯
- PWM可以考虑放到这里
- PWM
- SD_CS
- 3.3V升到5V，有隔离作用，支持高速信号（4040-6.0机器已量产使用）
- ESP32的是，不是ESP32s3,IO15默认上拉
  IO5默认上拉
  IO12默认下拉
  IO2默认下拉
- 3.3V升到5V，用于控制方向信号做够
- 插件USB
- 贴片USB
- 增加对地电阻
- TYPE-C接口，用于上位机通信，用贴片的或者长腿插件
- TTL转RS232，给触摸屏通信

# Board PCB
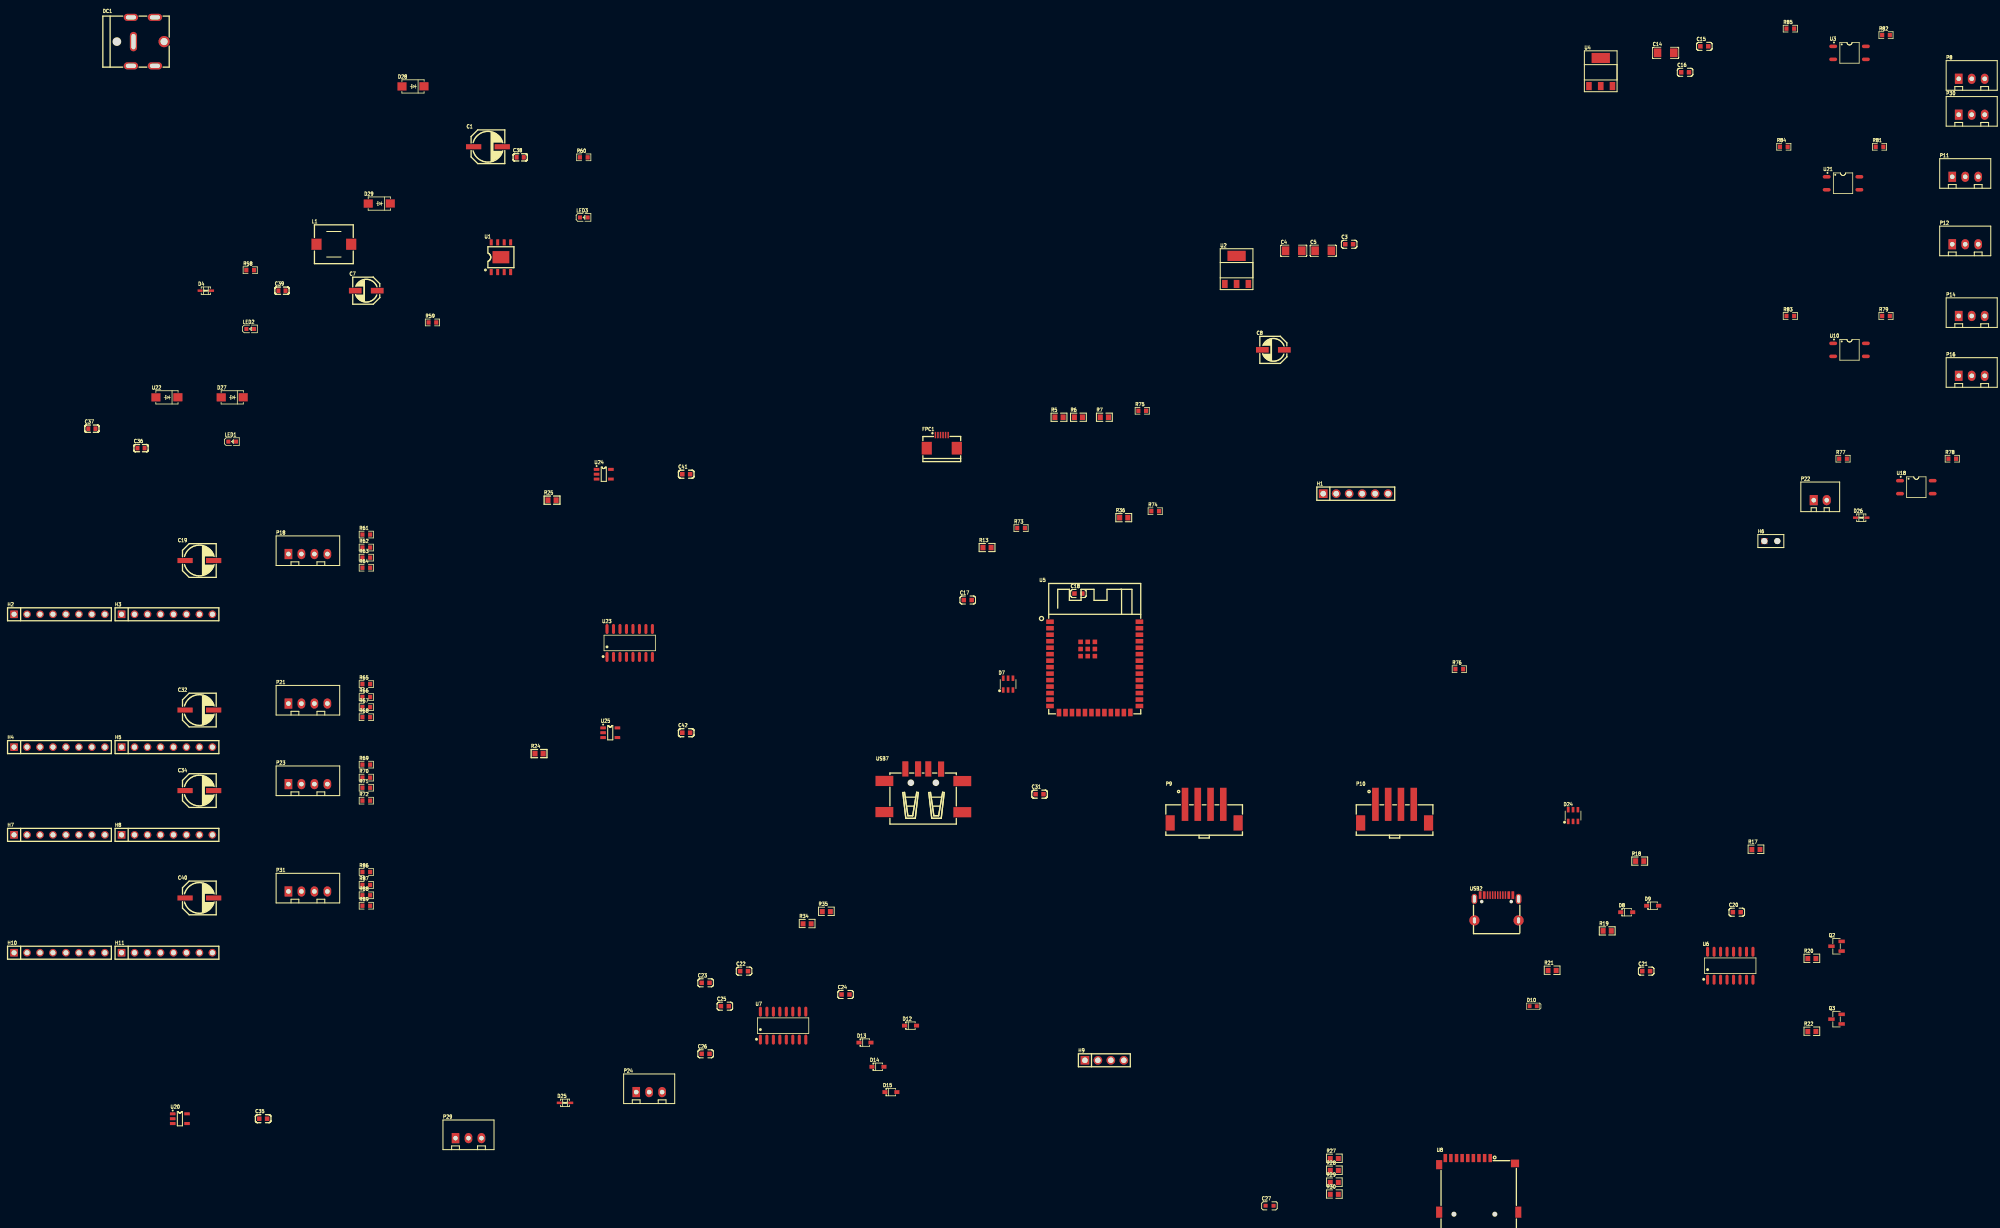
[diagram p1: board, top side]
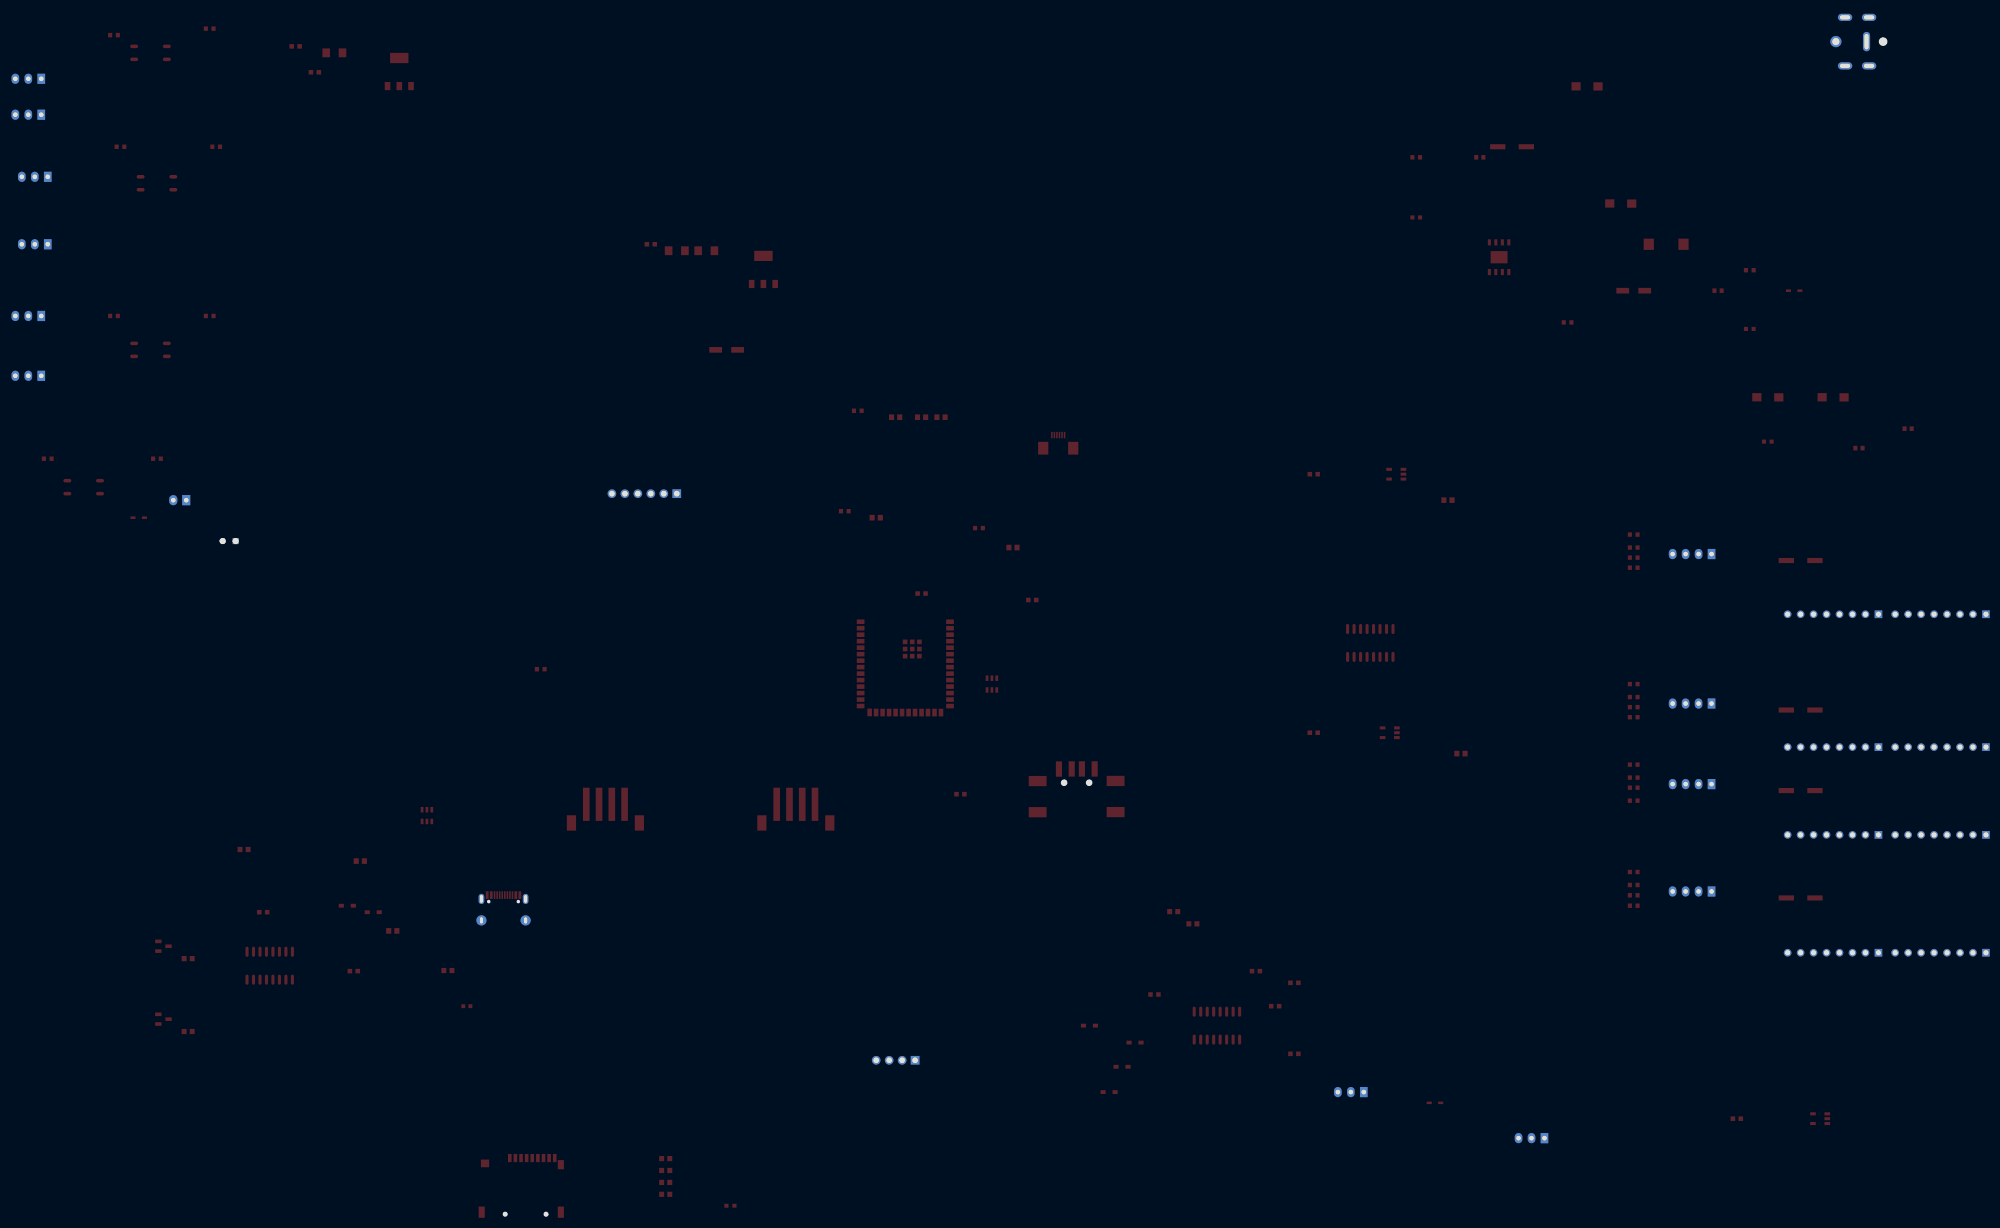
[diagram p2: board, bottom side, seen from below]

Outline 274.21 x 231 mm; copper layers: Top Layer, Bottom Layer. Coordinates in mm from the lower left corner of the outline.
Stack: Top Layer 0.035mm / Dielectric1 1.51mm FR4 er 4.5 / Bottom Layer 0.035mm

## Design rules (mm)
net D1+: DP2
net USB_D-: DP1
net SL_D-: DP3
net SL_D+: DP3
template: 用户自定义配置
spacing Default (default): track to track 0.152, other pairs 0 to 0.152
track width Default (default): min 0.254, default 0.254, max 25.4
differential pair differentialPair (default): width min 0.127, default 0.254, max 2.54; gap min 0.152, default 0.152
via Default (default): diameter min 0.25, default 0.61, max 100.025; hole min 0.2, default 0.305, max 59.995

## Placement (name value [footprint] x y rotation side)
C1  100uF/35V  [电解电容贴片6X6]  73.5 209.56 0 top
C3  104  [0603C]  242.13 190.47 0 top
C4  4.7uF  [C1206]  231.27 189.2 0 top
C5  4.7uF  [C1206]  237.05 189.2 0 top
C7  100uF/10V  [CAP-SMD_BD5.0-L5.3-W5.3-RD]  49.68 181.37 0 top
C8  100uF/10V  [CAP-SMD_BD5.0-L5.3-W5.3-RD]  227.29 169.78 0 top
C14  4.7uF  [C1206]  304.1 227.96 0 top
C15  104  [0603C]  311.67 229.23 0 top
C16  104  [0603C]  307.91 224.15 0 top
C17  104  [0603C]  167.44 120.79 0 top
C18  104  [0603C]  189.12 122.06 0 top
C19  100uF/35V  [电解电容贴片6X6]  16.99 128.53 0 top
C20  104  [0603C]  318.02 59.65 0 top
C21  104  [0603C]  300.29 48.11 0 top
C22  104  [0603C]  123.65 48.11 0 top
C23  104  [0603C]  116.12 45.82 0 top
C24  104  [0603C]  143.52 43.53 0 top
C25  104  [0603C]  119.89 41.24 0 top
C26  104  [0603C]  116.12 31.91 0 top
C27  104  [11]  227.29 1.85 0 top
C31  104  [0603C]  181.51 82.76 0 top
C32  100uF/35V  [电解电容贴片6X6]  16.99 99.24 0 top
C34  100uF/35V(47uF/50V)  [电解电容贴片6X6]  16.99 83.47 0 top
C35  104  [0603C]  29.49 19.21 0 top
C36  33pF  [C0603]  5.58 150.54 0 top
C37  0.1uF  [C0603]  -4.05 154.35 0 top
C38  0.1uF  [C0603]  79.82 207.49 0 top
C39  0.1uF  [C0603]  33.17 181.37 0 top
C40  100uF/35V  [电解电容贴片6X6]  16.99 62.44 0 top
C41  104  [0603C]  112.33 145.43 0 top
C42  104  [0603C]  112.33 94.8 0 top
D4  PESD5V0L1BA-N  [SOD-323_L1.8-W1.3-LS2.5-BI]  18.26 181.37 0 top
D7  USBLC6-2SC6  [SOT-23-6_L2.9-W1.6-P0.95-LS2.8-BL]  175.34 104.32 0 top
D8  1N4148  [SOD-323_L1.8-W1.3-LS2.5-RD]  296.48 59.65 0 top
D9  1N4148  [SOD-323_L1.8-W1.3-LS2.5-RD]  301.56 60.92 0 top
D10  LED红  [0603L]  278.16 41.24 0 top
D12  1N4148WS  [SOD-323_L1.8-W1.3-LS2.5-RD]  156.25 37.43 0 top
D13  1N4148WS  [SOD-323_L1.8-W1.3-LS2.5-RD]  147.33 34.11 0 top
D14  1N4148WS  [SOD-323_L1.8-W1.3-LS2.5-RD]  149.87 29.37 0 top
D15  1N4148WS  [SOD-323_L1.8-W1.3-LS2.5-RD]  152.41 24.42 0 top
D24  USBLC6-2SC6  [SOT-23-6_L2.9-W1.6-P0.95-LS2.8-BL]  285.97 78.57 0 top
D25  PESD5V0L1BA-N  [SOD-323_L1.8-W1.3-LS2.5-BI]  88.59 22.31 0 top
D26  PESD5V0L1BA-N  [SOD-323_L1.8-W1.3-LS2.5-BI]  342.4 136.91 0 top
D27  SS34-SMA  [SMA_L4.3-W2.6-LS5.0-FD]  23.42 160.49 0 top
D28  SS34  [SMA_L4.3-W2.6-LS5.0-FD]  58.82 221.39 0 top
D29  SS56  [SMA_L4.3-W2.6-LS5.0-FD]  52.22 198.44 0 top
DC1  DC007B-2.5  [DC-IN-TH_HX-DC007B-2.5]  6.85 230.16 0 top
FPC1  FPC-05F-6PH20(0.5)  [FPC-SMD_6P-P0.50_XUNPU_FPC-05F-6PH20]  162.36 151.81 0 top
H1  PZ254V-11-06P  [HDR-TH_6P-P2.54-V-M]  243.4 141.62 0 top
H2  PZ254V-11-08P  [HDR-TH_8P-P2.54-V-M]  -10.4 118 0 top
H3  PZ254V-11-08P  [HDR-TH_8P-P2.54-V-M]  10.66 118 0 top
H4  PZ254V-11-08P  [HDR-TH_8P-P2.54-V-M]  -10.4 91.98 0 top
H5  PZ254V-11-08P  [HDR-TH_8P-P2.54-V-M]  10.66 91.98 0 top
H6  PZ254V-11-02P  [HDR-TH_2P-P2.54-V-M]  324.7 132.34 0 top
H7  PZ254V-11-08P  [HDR-TH_8P-P2.54-V-M]  -10.4 74.79 0 top
H8  PZ254V-11-08P  [HDR-TH_8P-P2.54-V-M]  10.66 74.79 0 top
H9  PZ254V-11-04P  [HDR-TH_4P-P2.54-V-M]  194.2 30.64 0 top
H10  PZ254V-11-08P  [HDR-TH_8P-P2.54-V-M]  -10.4 51.71 0 top
H11  PZ254V-11-08P  [HDR-TH_8P-P2.54-V-M]  10.66 51.71 0 top
L1  68uH  [IND-SMD_L7.0-W7.0_SMDRI74-330MT]  43.33 190.47 0 top
LED1  绿光  [LED0603-RD]  23.42 151.81 0 top
LED2  绿光  [LED0603-RD]  26.95 173.88 0 top
LED3  绿光  [LED0603-RD]  92.27 195.72 0 top
P8  3P  [HDR1X3_CON]  364.02 222.88 0 top
P9  2.54-4PLTDK  [CONN-SMD_4P-P2.50_SHOU_2.54-4PLTDK]  213.74 78.95 0 top
P10  2.54-4PLTDK  [CONN-SMD_4P-P2.50_SHOU_2.54-4PLTDK]  251.02 78.95 0 top
P11  3P  [HDR1X3_CON]  362.75 203.68 0 top
P12  3P  [HDR1X3_CON]  362.75 190.47 0 top
P14  3P  [HDR1X3_CON]  364.02 176.42 0 top
P16  3P  [HDR1X3_CON]  364.02 164.7 0 top
P18  4P  [HDR1X4_CON]  34.44 129.8 0 top
P21  4P  [HDR1X4_CON]  34.44 100.51 0 top
P22  2P  [HDR1X2_CON]  334.37 140.35 0 top
P23  4P  [HDR1X4_CON]  34.44 84.74 0 top
P24  3P  [HDR1X3_CON]  105.07 24.42 0 top
P29  3P  [HDR1X3_CON]  69.69 15.4 0 top
P30  3P  [HDR1X3_CON]  364.02 215.84 0 top
P31  4P  [HDR1X4_CON]  34.44 63.71 0 top
Q2  SS8050  [SOT-23-3_L2.9-W1.3-P1.90-LS2.4-BR]  337.56 52.98 0 top
Q3  SS8050  [SOT-23-3_L2.9-W1.3-P1.90-LS2.4-BR]  337.56 38.7 0 top
R5  10K  [0603R]  185.32 156.59 0 top
R6  10K  [0603R]  189.12 156.59 0 top
R7  10K  [0603R]  194.2 156.59 0 top
R13  10K  [0603R]  171.23 131.07 0 top
R17  0Ω  [10]  320.89 71.81 0 top
R18  10K  [0603R]  299.02 69.66 0 top
R19  10K  [0603R]  292.66 55.98 0 top
R20  10K  [10]  331.83 50.44 0 top
R21  47K  [10]  280.97 48.11 0 top
R22  10K  [10]  331.83 36.16 0 top
R24  10K  [0603R]  83.51 90.71 0 top
R25  10K  [0603R]  86.05 140.35 0 top
R27  10K  [10]  238.32 11.28 0 top
R28  10K  [10]  238.32 8.94 0 top
R29  10K  [10]  238.32 6.61 0 top
R30  10K  [10]  238.32 4.27 0 top
R34  10K  [10]  135.1 57.25 0 top
R35  10K  [10]  138.86 59.65 0 top
R36  10K  [0603R]  198 136.91 0 top
R58  20kΩ  [R0603]  26.95 185.39 0 top
R59  10kΩ  [R0603]  62.63 175.15 0 top
R60  100kΩ  [R0603]  92.27 207.49 0 top
R61  2k  [R0603]  49.68 133.61 0 top
R62  2k  [R0603]  49.68 131.07 0 top
R63  2k  [R0603]  49.68 129.09 0 top
R64  2k  [R0603]  49.68 127.12 0 top
R65  2k  [R0603]  49.68 104.32 0 top
R66  2k  [R0603]  49.68 101.78 0 top
R67  2k  [R0603]  49.68 99.81 0 top
R68  2k  [R0603]  49.68 97.83 0 top
R69  2k  [R0603]  49.68 88.55 0 top
R70  2k  [R0603]  49.68 86.01 0 top
R71  2k  [R0603]  49.68 84.03 0 top
R72  2k  [R0603]  49.68 81.49 0 top
R73  10K  [R0603]  177.88 134.88 0 top
R74  10K  [R0603]  204.15 138.18 0 top
R75  10K  [R0603]  201.61 157.86 0 top
R76  10K  [R0603]  263.69 107.24 0 top
R77  1K  [R0603]  338.83 148.47 0 top
R78  10K  [R0603]  360.21 148.47 0 top
R79  4.7K  [R0603]  347.24 176.42 0 top
R81  4.7K  [R0603]  345.97 209.56 0 top
R82  4.7K  [R0603]  347.24 231.43 0 top
R83  47K  [R0603]  328.51 176.42 0 top
R84  47K  [R0603]  327.24 209.56 0 top
R85  47K  [R0603]  328.51 232.7 0 top
R86  2k  [R0603]  49.68 67.52 0 top
R87  2k  [R0603]  49.68 64.98 0 top
R88  2k  [R0603]  49.68 62.96 0 top
R89  2k  [R0603]  49.68 60.92 0 top
U1  XL1509-5.0E1  [ESOP-8_L4.9-W3.9-P1.27-LS6.0-BL-EP]  76.04 187.93 0 top
U2  1117-3.3  [SOT-223]  220.09 185.39 0 top
U3  LTV-357T-C  [SOP-4_L4.4-W3.9-P2.54-LS7.0-TL]  340.1 227.96 0 top
U4  1117-3.3  [SOT-223]  291.39 224.15 0 top
U5  ESPS3-32-WROOM-1-N16R8  [WIRELM-SMD_ESP32-S3-WROOM-2-N32R8V]  192.3 107.64 0 top
U6  CH340C  [SOIC-16_L9.9-W3.9-P1.27-LS6.0-BL]  316.75 49.17 0 top
U7  SP3232EEN-L/TR  [SOIC-16_L9.9-W3.9-P1.27-LS6.0-BL]  131.29 37.43 0 top
U8  自弹TF卡座TFAA  [SIM-SMD_C9900015645]  267.5 6.2 0 top
U10  LTV-357T-C  [SOP-4_L4.4-W3.9-P2.54-LS7.0-TL]  340.1 169.78 0 top
U18  LTV-357T-C  [SOP-4_L4.4-W3.9-P2.54-LS7.0-TL]  353.18 142.89 0 top
U20  74LVC1G17  [SOT-23-5]  13.18 19.21 0 top
U21  LTV-357T-C  [SOP-4_L4.4-W3.9-P2.54-LS7.0-TL]  338.83 202.41 0 top
U22  SS34A  [SMA_L4.3-W2.6-LS5.0-FD]  10.64 160.49 0 top
U23  CA-IS3760  [SOIC-16_L9.9-W3.9-P1.27-LS6.0-BL]  101.26 112.38 0 top
U24  74LVC1G17  [SOT-23-5]  96.18 145.43 0 top
U25  74LVC1G17  [SOT-23-5]  97.45 94.8 0 top
USB2  TYPE-C 16PIN  [USB-C-SMD_TYPE-C-6PIN+]  270.98 60.42 0 top
USB7  AF 10.0 QT-ZB6.8  [USB-A-SMD_AF-10.0-QT-ZB6.8]  158.76 83.47 0 top

## Footprints (pads in the part's own frame, mm; a bottom-side part is the same pattern mirrored in y, then rotated)
10
  rect 0.965x1.016 smd: 1(0.101,0.117) 2(1.688,0.117)
11
  rect 0.813x0.762 smd: 1(0.043,0.296) 2(-1.524,0.301)
0603C
  rect 0.889x0.889 smd: 1(-0.774,0) 2(0.774,0)
0603L
  rect 0.762x0.762 smd: 1(-0.699,0) 2(0.699,0)
0603R
  rect 1x1.1 smd: 1(-0.8,0) 2(0.8,0)
C0603
  rect 0.8x0.9 smd: 1(-0.7,0) 2(0.7,0)
C1206
  rect 1.485x1.728 smd: 1(-1.593,0) 2(1.593,0)
CAP-SMD_BD5.0-L5.3-W5.3-RD
  rect 2.5x1.1 smd: 1(2.15,0) 2(-2.15,0)
CONN-SMD_4P-P2.50_SHOU_2.54-4PLTDK
  rect 1.3x6.5 smd: 1(-3.75,1.825) 2(-1.25,1.825) 3(1.25,1.825) 4(3.75,1.825)
  rect 1.8x3 smd: 5(6.65,-1.825) 6(-6.65,-1.825)
DC-IN-TH_HX-DC007B-2.5
  round 2.2 hole 1.4: 1(3.25,0)
  oval 1.4x3.8 hole 0.8x3: 2(-2.75,0)
  oval 2.8x1.4 hole 2x0.8: 3(-3.25,4.75) 3(-3.25,-4.75) 3(1.45,4.75) 3(1.45,-4.75)
ESOP-8_L4.9-W3.9-P1.27-LS6.0-BL-EP
  rect 0.6x1.2 smd: 1(-1.905,-2.909) 2(-0.635,-2.909) 3(0.635,-2.909) 4(1.905,-2.909) 5(1.905,2.909) 6(0.635,2.909) 7(-0.635,2.909) 8(-1.905,2.909)
  rect 3.3x2.4 smd: 9(0,0)
FPC-SMD_6P-P0.50_XUNPU_FPC-05F-6PH20
  rect 0.3x1.25 smd: 1(-1.25,1.288) 2(-0.75,1.288) 3(-0.25,1.288) 4(0.25,1.288) 5(0.75,1.288) 6(1.25,1.288)
  rect 2x2.5 smd: 7(2.94,-1.288) 8(-2.94,-1.288)
HDR1X2_CON
  rect 1.6x2 hole 0.9: 1(-1.27,0)
  oval 1.6x2 hole 0.9: 2(1.27,0)
HDR1X3_CON
  rect 1.5x2 hole 0.9: 1(-2.54,0)
  oval 1.5x2 hole 0.9: 2(0,0) 3(2.54,0)
HDR1X4_CON
  rect 1.5x2 hole 0.9: 1(0,0)
  oval 1.5x2 hole 0.9: 2(2.54,0) 3(5.08,0) 4(7.62,0)
HDR-TH_2P-P2.54-V-M
  rect 1.2x1.2 hole 1.2x0.8: 1(-1.27,0)
  round 1.2 hole 1.2x0.8: 2(1.27,0)
HDR-TH_4P-P2.54-V-M
  rect 1.7x1.7 hole 1.1: 1(-3.81,0)
  round 1.7 hole 1.1: 2(-1.27,0) 3(1.27,0) 4(3.81,0)
HDR-TH_6P-P2.54-V-M
  rect 1.7x1.7 hole 1.1: 1(-6.35,0)
  round 1.7 hole 1.1: 2(-3.81,0) 3(-1.27,0) 4(1.27,0) 5(3.81,0) 6(6.35,0)
HDR-TH_8P-P2.54-V-M
  rect 1.5x1.5 hole 1: 1(-8.89,0)
  round 1.5 hole 1: 2(-6.35,0) 3(-3.81,0) 4(-1.27,0) 5(1.27,0) 6(3.81,0) 7(6.35,0) 8(8.89,0)
IND-SMD_L7.0-W7.0_SMDRI74-330MT
  rect 2x2.2 smd: 1(-3.4,0) 2(3.4,0)
LED0603-RD
  rect 0.8x0.8 smd: 1(-0.749,0) 2(0.749,0)
R0603
  rect 0.806x0.864 smd: 1(-0.753,0) 2(0.753,0)
SIM-SMD_C9900015645
  rect 0.7x1.6 smd: 1(2.25,5.3) 2(1.15,5.3) 3(0.05,5.3) 4(-1.05,5.3) 5(-2.15,5.3) 6(-3.25,5.3) 7(-4.35,5.3) 8(-5.45,5.3) 9(-6.55,5.3)
  rect 1.2x1.8 smd: 10(-7.75,4)
  rect 1.6x1.5 smd: 11(7.1,4.25)
  rect 1.2x2.2 smd: 12(-7.75,-5.3) 13(7.75,-5.3)
SMA_L4.3-W2.6-LS5.0-FD
  rect 1.8x1.62 smd: 1(-2.15,-0.009) 2(2.15,0.009)
SOD-323_L1.8-W1.3-LS2.5-BI
  rect 0.986x0.49 smd: 1(-1.117,0) 2(1.117,0)
SOD-323_L1.8-W1.3-LS2.5-RD
  rect 1x0.75 smd: 1(-1.173,0) 2(1.173,0)
SOIC-16_L9.9-W3.9-P1.27-LS6.0-BL
  oval 0.602x1.971 smd: 1(-4.445,-2.736) 2(-3.175,-2.736) 3(-1.905,-2.736) 4(-0.635,-2.736) 5(0.635,-2.736) 6(1.905,-2.736) 7(3.175,-2.736) 8(4.445,-2.736) 9(4.445,2.736) 10(3.175,2.736) 11(1.905,2.736) 12(0.635,2.736) 13(-0.635,2.736) 14(-1.905,2.736) 15(-3.175,2.736) 16(-4.445,2.736)
SOP-4_L4.4-W3.9-P2.54-LS7.0-TL
  oval 1.55x0.7 smd: 1(-3.2,1.27) 2(-3.2,-1.27) 3(3.2,-1.27) 4(3.2,1.27)
SOT-23-3_L2.9-W1.3-P1.90-LS2.4-BR
  rect 1.25x0.7 smd: 1(1,-0.95) 2(1,0.95) 3(-1,0)
SOT-23-5
  rect 1.1x0.6 smd: 1(-1.4,0.95) 2(-1.4,0) 3(-1.4,-0.95) 4(1.4,-0.95) 5(1.4,0.95)
SOT-23-6_L2.9-W1.6-P0.95-LS2.8-BL
  rect 0.532x1.072 smd: 1(-0.95,-1.149) 2(0,-1.149) 3(0.95,-1.149) 4(0.95,1.149) 5(0,1.149) 6(-0.95,1.149)
SOT-223
  rect 1.1x1.6 smd: 1(-2.3,-2.7) 2(0,-2.7) 3(2.3,-2.7)
  rect 3.6x2 smd: 4(0,2.8)
USB-A-SMD_AF-10.0-QT-ZB6.8
  rect 1.2x3 smd: 1(-3.528,4.237) 2(-1.028,4.237) 3(0.972,4.237) 4(3.472,4.213)
  rect 3.5x2 smd: 5(-7.628,-4.213) 5(-7.622,1.887) 5(7.628,1.863) 5(7.628,-4.237)
USB-C-SMD_TYPE-C-6PIN+
  rect 0.55x1.5 smd: 1(-3.2,2.575) 2(-2.4,2.575) 11(2.4,2.575) 12(3.2,2.575)
  rect 0.3x1.5 smd: 3(-1.75,2.575) 4(-1.25,2.575) 5(-0.75,2.575) 6(-0.25,2.575) 7(0.25,2.575) 8(0.75,2.575) 9(1.25,2.575) 10(1.75,2.575)
  oval 1.1x2 hole 0.6x1.5: 13(-4.325,1.825) 14(4.325,1.825)
  oval 2x2 hole 0.6x1.2: 13(-4.325,-2.375) 14(4.325,-2.375)
WIRELM-SMD_ESP32-S3-WROOM-2-N32R8V
  rect 1.5x0.9 smd: 1(-8.75,8.895) 2(-8.75,7.625) 3(-8.75,6.355) 4(-8.75,5.085) 5(-8.75,3.815) 6(-8.75,2.545) 7(-8.75,1.275) 8(-8.75,0.005) 9(-8.75,-1.265) 10(-8.75,-2.535) 11(-8.75,-3.805) 12(-8.75,-5.075) 13(-8.75,-6.345) 14(-8.75,-7.615) 27(8.75,-7.615) 28(8.75,-6.345) 29(8.75,-5.075) 30(8.75,-3.805) 31(8.75,-2.535) 32(8.75,-1.265) 33(8.75,0.005) 34(8.75,1.275) 35(8.75,2.545) 36(8.75,3.815) 37(8.75,5.085) 38(8.75,6.355) 39(8.75,7.625) 40(8.75,8.895)
  rect 0.9x1.5 smd: 15(-6.985,-8.895) 16(-5.715,-8.895) 17(-4.445,-8.895) 18(-3.175,-8.895) 19(-1.905,-8.895) 20(-0.635,-8.895) 21(0.635,-8.895) 22(1.905,-8.895) 23(3.175,-8.895) 24(4.445,-8.895) 25(5.715,-8.895) 26(6.985,-8.865)
  rect 0.9x0.9 smd: 41(-2.76,4.955) 41(-2.76,3.555) 41(-2.76,2.155) 41(-1.36,4.955) 41(-1.36,3.555) 41(-1.36,2.155) 41(0.04,4.955) 41(0.04,3.555) 41(0.04,2.155)
电解电容贴片6X6
  rect 3x1 smd: 1(-2.8,0) 2(2.8,0)

## Nets
As in the schematic, except:
3V3: C3.2 C4.2 C5.2 C18.2 C27.2 R13.1 R18.2 R27.2 R28.2 R29.2 R30.2 R36.1 R76.1 U2.2 U2.4 U5.2 U8.4 U23.1
3V3_CM: C14.2 C15.2 C16.2 FPC1.5 R5.1 R6.1 R7.1 U4.2 U4.4
5V_SHAOLU: R17.1 R21.1 USB2.2 USB2.11
5V_VCC: C7.1 C8.1 C20.1 C24.2 C31.1 C35.2 C39.2 C41.2 C42.2 D4.2 D7.5 H1.1 L1.1 P10.1 R17.2 R19.1 R34.1 R35.1 R58.2 R77.1 R78.1 R83.1 R84.1 R85.1 U1.3 U2.3 U4.3 U6.16 U7.16 U20.5 U23.16 U24.5 U25.5 USB7.1
12V_DIV: C19.1 C32.1 C34.1 C40.1 H3.8 H5.8 H8.8 H11.8
24V_D1: C1.1 C38.1 D28.1 P8.2 P11.2 P12.2 P14.2 P16.2 P24.2 P30.2 R60.2 R79.1 R81.1 R82.1 U1.1
GND: C1.2 C3.1 C4.1 C5.1 C7.2 C8.2 C14.1 C15.1 C16.1 C17.1 C18.1 C19.2 C20.2 C21.2 C22.1 C24.1 C26.2 C27.1 C31.2 C32.2 C34.2 C35.1 C38.2 C39.1 C40.2 C41.1 C42.1 D4.1 D7.2 D10.2 D24.2 D25.1 D26.1 D29.2 DC1.2 DC1.3 FPC1.4 FPC1.7 FPC1.8 H1.2 H3.1 H3.7 H5.1 H5.7 H8.1 H8.7 H11.1 H11.7 LED2.1 LED3.1 P8.3 P9.4 P9.5 P9.6 P10.4 P10.5 P10.6 P11.3 P12.3 P14.3 P16.3 P22.2 P24.3 P29.3 P30.3 R24.2 R25.2 R59.1 R61.1 R62.1 R63.1 R64.1 R65.1 R66.1 R67.1 R68.1 R69.1 R70.1 R71.1 R72.1 R86.1 R87.1 R88.1 R89.1 U1.5 U1.6 U1.7 U1.8 U2.1 U3.3 U4.1 U5.1 U5.40 U5.41 U6.1 U7.15 U8.6 U8.10 U8.11 U8.12 U8.13 U10.3 U18.3 U20.3 U21.3 U23.8 U23.9 U24.3 U25.3 USB2.1 USB2.12 USB2.13 USB2.14 USB7.4 USB7.5
VIN24V: D28.2 DC1.1 P9.1
CPT_RST: FPC1.6 R5.2
DTR: Q2.2 R22.2 U6.13
ESP_RST: C17.2 H1.5 Q3.3 R13.2 U5.3
IO4_INT: FPC1.3 U5.4
IO8_SDA: FPC1.2 R7.2 U5.12
IO9_SCL: FPC1.1 R6.2 U5.17
R: D8.2 R19.2 U6.3
RTS: Q3.2 R20.2 U6.14
RXD0: D9.2 D15.2 H1.4 H9.1 R18.1 U5.36
RXD1: D12.2 H9.4 R36.2 U5.8
SL_D+: D24.3 U6.5 USB2.6 USB2.8
SL_D-: D24.1 U6.6 USB2.5 USB2.7
T: D9.1 U6.2
$9N275850: C21.1 U6.4
$9N275879: Q2.1 R20.1
$9N275880: Q3.1 R22.1
$9N276006: D10.1 R21.2

Pads without a net: C36 1 2; C37 1 2; D27 1 2; LED1 1 2; P29 2; R73 1 2; R74 1 2; R75 1 2; U1 9; U5 28 29 30; U6 7 8 9 10 11 12 15; U8 1 8; U20 1; U22 1 2; U24 1; U25 1; USB2 3 9
